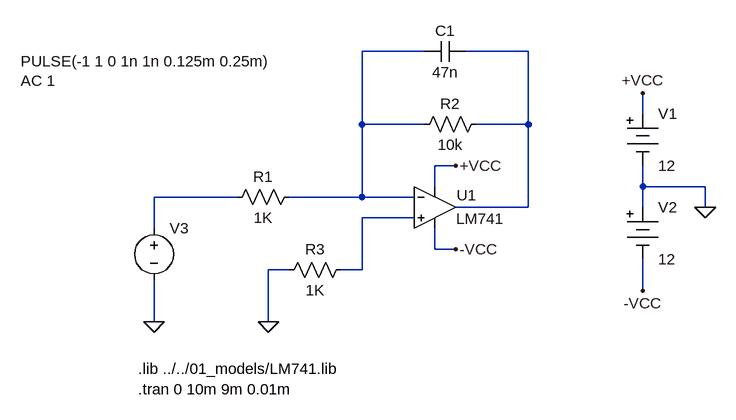
[diagram p0: schematic opamp_05_02_04_int_tran_squ.asc]
opamp_05_02_04_int_tran_squ.asc, the LTspice schematic file:
Version 4
SHEET 1 880 680
WIRE 32 -128 -64 -128
WIRE 192 -128 96 -128
WIRE 368 -32 368 -64
WIRE -64 -16 -64 -128
WIRE 32 -16 -64 -16
WIRE 192 -16 192 -128
WIRE 192 -16 112 -16
WIRE 80 48 48 48
WIRE 48 80 48 48
WIRE 368 80 368 48
WIRE 464 80 368 80
WIRE -256 96 -384 96
WIRE -64 96 -64 -16
WIRE -64 96 -176 96
WIRE 16 96 -64 96
WIRE 192 112 192 -16
WIRE 192 112 80 112
WIRE 368 112 368 80
WIRE 464 112 464 80
WIRE 16 128 -64 128
WIRE -384 144 -384 96
WIRE 48 176 48 144
WIRE 80 176 48 176
WIRE -176 208 -208 208
WIRE -64 208 -64 128
WIRE -64 208 -96 208
WIRE 368 240 368 192
WIRE -384 288 -384 224
WIRE -208 288 -208 208
FLAG 464 112 0
FLAG 368 -64 +VCC
FLAG 368 240 -VCC
FLAG -208 288 0
FLAG -384 288 0
FLAG 80 48 +VCC
FLAG 80 176 -VCC
SYMBOL Misc\\battery 368 -48 R0
WINDOW 123 0 0 Left 2
WINDOW 39 0 0 Left 2
SYMATTR InstName V1
SYMATTR Value 12
SYMBOL Misc\\battery 368 96 R0
WINDOW 123 0 0 Left 2
WINDOW 39 0 0 Left 2
SYMATTR InstName V2
SYMATTR Value 12
SYMBOL res -160 80 R90
WINDOW 0 0 56 VBottom 2
WINDOW 3 32 56 VTop 2
SYMATTR InstName R1
SYMATTR Value 1K
SYMBOL res 128 -32 R90
WINDOW 0 0 56 VBottom 2
WINDOW 3 32 56 VTop 2
SYMATTR InstName R2
SYMATTR Value 10k
SYMBOL voltage -384 128 R0
WINDOW 123 -205 -211 Left 2
WINDOW 39 0 0 Left 2
WINDOW 3 -205 -241 Left 2
SYMATTR Value2 AC 1
SYMATTR Value PULSE(-1 1 0 1n 1n 0.125m 0.25m)
SYMATTR InstName V3
SYMBOL Opamps\\opamp2 48 48 R0
WINDOW 0 34 45 Left 2
WINDOW 3 33 81 Left 2
SYMATTR InstName U1
SYMATTR Value LM741
SYMBOL res -80 192 R90
WINDOW 0 0 56 VBottom 2
WINDOW 3 32 56 VTop 2
SYMATTR InstName R3
SYMATTR Value 1K
SYMBOL cap 96 -144 R90
WINDOW 0 0 32 VBottom 2
WINDOW 3 32 32 VTop 2
SYMATTR InstName C1
SYMATTR Value 47n
TEXT -408 360 Left 2 !.lib ../../01_models/LM741.lib
TEXT -408 392 Left 2 !.tran 0 10m 9m 0.01m

The netlist it stands for:
* opamp_05_02_04_int_tran_squ.asc
V1 +VCC 0 12
V2 0 -VCC 12
R1 N001 N003 1K
R2 N002 N001 10k
V3 N003 0 PULSE(-1 1 0 1n 1n 0.125m 0.25m) AC 1
XU1 N004 N001 +VCC -VCC N002 LM741  ; pins In+ In- V+ V- OUT
R3 N004 0 1K
C1 N002 N001 47n
.lib ../../01_models/LM741.lib
.tran 0 10m 9m 0.01m
.backanno
.end